# EAGLE schematic enrgymeter - Copy (EAGLE 9.0.0)
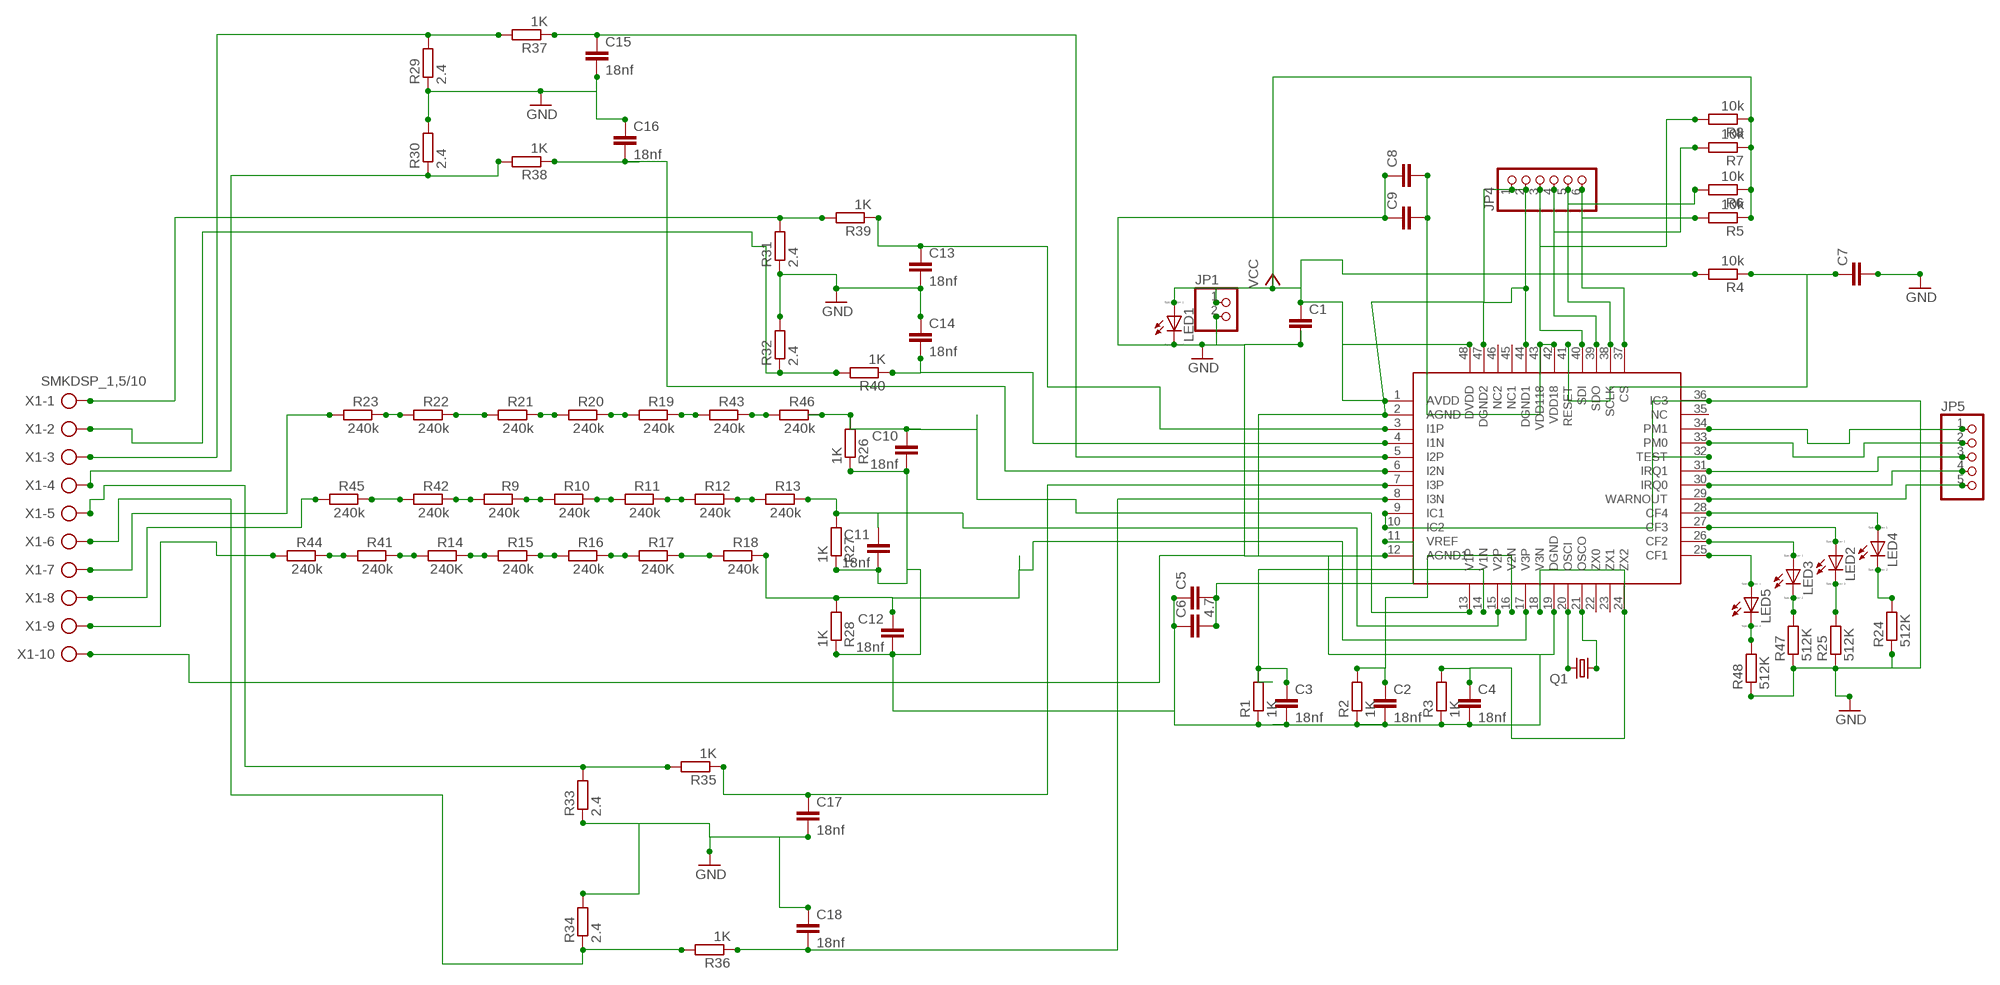
[diagram p0: schematic, sheet 1]

## Parts
C1  C-EUC1210  [C1210]
C2  18nf  C-EUC0402  [C0402]
C3  18nf  C-EUC0402  [C0402]
C4  18nf  C-EUC0402  [C0402]
C5  C-EUC1210  [C1210]
C6  4.7  C-EUC0805  [C0805]
C7  C-EUC1210  [C1210]
C8  C-EUC1210  [C1210]
C9  C-EUC1210  [C1210]
C10  18nf  C-EUC0402  [C0402]
C11  18nf  C-EUC0402  [C0402]
C12  18nf  C-EUC0402  [C0402]
C13  18nf  C-EUC0402  [C0402]
C14  18nf  C-EUC0402  [C0402]
C15  18nf  C-EUC0402  [C0402]
C16  18nf  C-EUC0402  [C0402]
C17  18nf  C-EUC0402  [C0402]
C18  18nf  C-EUC0402  [C0402]
JP1  PINHD-1X2_2.54-SMD-90°  [1X02SMD/90]
JP4  PINHD-1X6_2.54-SMD-90°  [1X06SMD/90]
JP5  PINHD-1X5_2.54-SMD-90°  [1X05SMD/90]
LED1  LED_E  [LED_1206]
LED2  LED_E  [LED_1206]
LED3  LED_E  [LED_1206]
LED4  LED_E  [LED_1206]
LED5  LED_E  [LED_1206]
Q1  CRYSTALSM49  [SM49]
R1  1K  R-EU_R2512  [R2512]
R2  1K  R-EU_R2512  [R2512]
R3  1K  R-EU_R2512  [R2512]
R4  10k  R-EU_R2512  [R2512]
R5  10k  R-EU_R2512  [R2512]
R6  10k  R-EU_R2512  [R2512]
R7  10k  R-EU_R2512  [R2512]
R8  10k  R-EU_R2512  [R2512]
R9  240k  R-EU_R2512W  [R2512W]
R10  240k  R-EU_R2512W  [R2512W]
R11  240k  R-EU_R2512W  [R2512W]
R12  240k  R-EU_R2512W  [R2512W]
R13  240k  R-EU_R2512W  [R2512W]
R14  240K  R-EU_R2512W  [R2512W]
R15  240k  R-EU_R2512W  [R2512W]
R16  240k  R-EU_R2512W  [R2512W]
R17  240K  R-EU_R2512W  [R2512W]
R18  240k  R-EU_R2512W  [R2512W]
R19  240k  R-EU_R2512W  [R2512W]
R20  240k  R-EU_R2512W  [R2512W]
R21  240k  R-EU_R2512W  [R2512W]
R22  240k  R-EU_R2512W  [R2512W]
R23  240k  R-EU_R2512W  [R2512W]
R24  512K  R-EU_R2512W  [R2512W]
R25  512K  R-EU_R2512W  [R2512W]
R26  1K  R-EU_R2512  [R2512]
R27  1K  R-EU_R2512  [R2512]
R28  1K  R-EU_R2512  [R2512]
R29  2.4  R-EU_R2512  [R2512]
R30  2.4  R-EU_R2512  [R2512]
R31  2.4  R-EU_R2512  [R2512]
R32  2.4  R-EU_R2512  [R2512]
R33  2.4  R-EU_R2512  [R2512]
R34  2.4  R-EU_R2512  [R2512]
R35  1K  R-EU_R2512  [R2512]
R36  1K  R-EU_R2512  [R2512]
R37  1K  R-EU_R2512  [R2512]
R38  1K  R-EU_R2512  [R2512]
R39  1K  R-EU_R2512  [R2512]
R40  1K  R-EU_R2512  [R2512]
R41  240k  R-EU_R2512W  [R2512W]
R42  240k  R-EU_R2512W  [R2512W]
R43  240k  R-EU_R2512W  [R2512W]
R44  240k  R-EU_R2512W  [R2512W]
R45  240k  R-EU_R2512W  [R2512W]
R46  240k  R-EU_R2512W  [R2512W]
R47  512K  R-EU_R2512W  [R2512W]
R48  512K  R-EU_R2512W  [R2512W]
U$1  M90E32AS  [M90E32AS]
X1  SMKDSP_1,5/10  [SMKDSP_1,5/10]

## Nets
GND: C1.2 C2.2 C3.2 C4.2 C5.1 C6.1 C7.2 C8.1 C9.1 C10.2 C11.2 C12.2 C13.2 C14.1 C15.2 C16.1 C17.2 C18.1 JP1.2 JP4.1 JP4.2 LED1.C R1.1 R2.1 R3.1 R24.1 R25.1 R26.1 R27.1 R28.1 R29.1 R30.2 R31.1 R32.2 R33.1 R34.2 R47.1 R48.1 U$1.2(AGND) U$1.9(IC1) U$1.10(IC2) U$1.12(AGND1) U$1.19(DGND) U$1.32(TEST) U$1.36(IC3) U$1.44(DGND1) U$1.47(DGND2) X1.10
N$1: JP4.6 R5.2 U$1.37(CS)
N$2: JP4.5 R6.2 U$1.38(SCLK)
N$3: JP4.4 R7.2 U$1.39(SDO)
N$4: JP4.3 R8.2 U$1.40(SDI)
N$5: C7.1 R4.1 U$1.41(RESET)
N$6: Q1.1 U$1.21(OSCO)
N$7: R12.1 R13.2
N$8: Q1.2 U$1.20(OSCI)
N$9: C8.2 C9.2 U$1.42(VDD18) U$1.43(VDD118)
N$10: C14.2 R40.1 U$1.4(I1N)
N$11: R31.2 R39.2 X1.1
N$12: R32.1 R40.2 X1.2
N$13: C17.1 R35.1 U$1.7(I3P)
N$14: R43.1 R46.2
N$16: R19.1 R43.2
N$17: LED4.A U$1.28(CF4)
N$19: LED2.A U$1.27(CF3)
N$20: R42.2 R45.1
N$21: LED5.C R48.2
N$22: JP5.1 U$1.34(PM1)
N$23: LED5.A U$1.25(CF1)
N$24: JP5.2 U$1.33(PM0)
N$25: JP5.3 U$1.31(IRQ1)
N$26: C11.1 R13.1 R27.2 U$1.15(V2P)
N$27: R41.2 R44.1
N$28: LED3.A U$1.26(CF2)
N$29: JP5.4 U$1.30(IRQ0)
N$31: JP5.5 U$1.29(WARNOUT)
N$32: R11.1 R12.2
N$33: R19.2 R20.1
N$34: R10.1 R11.2
N$35: R45.2 X1.8
N$36: C16.2 R38.1 U$1.6(I2N)
N$37: C10.1 R26.2 R46.1 U$1.13(V1P)
N$38: R20.2 R21.1
N$39: C3.1 R1.2 U$1.14(V1N)
N$40: C2.1 R2.2 U$1.16(V2N)
N$41: R9.1 R10.2
N$42: C4.1 R3.2 U$1.18(V3N) U$1.24(ZX2)
N$43: LED3.C R47.2
N$44: R9.2 R42.1
N$45: R34.1 R36.2 X1.6
N$46: R14.2 R41.1
N$47: C5.2 C6.2 U$1.11(VREF)
N$48: R21.2 R22.1
N$49: R14.1 R15.2
N$50: R29.2 R37.2 X1.3
N$51: R15.1 R16.2
N$52: R22.2 R23.1
N$53: R16.1 R17.2
N$55: R17.1 R18.2
N$57: C12.1 R18.1 R28.2 U$1.17(V3P)
N$58: R33.2 R35.2 X1.5
N$59: LED2.C R25.2
N$60: LED4.C R24.2
N$61: C13.1 R39.1 U$1.3(I1P)
N$63: R23.2 X1.7
N$66: R44.2 X1.9
N$71: R30.1 R38.2 X1.4
N$82: C15.1 R37.1 U$1.5(I2P)
N$87: C18.2 R36.1 U$1.8(I3N)
VCC: C1.1 JP1.1 LED1.A R4.2 R5.1 R6.1 R7.1 R8.1 U$1.1(AVDD) U$1.48(DVDD)
Unconnected: U$1.22(ZX0) U$1.23(ZX1) U$1.35(NC) U$1.45(NC1) U$1.46(NC2)

## Library data of the parts
C1-C18 = rcl:C-EU: CAPACITOR, European symbol
JP1 = pinhead-1:PINHD-1X2: PIN HEADER
JP4 = pinhead-1:PINHD-1X6: PIN HEADER
JP5 = pinhead-1:PINHD-1X5: PIN HEADER
LED1-LED5 = eagle-ltspice:LED_E: LED Source: http://www.osram.convergy.de Source: www.luxeon.com Source: www.kingbright.com; SPICEMODEL: NONE; SPICEPREFIX: D; SPICETYPE: diode
Q1 = crystal:CRYSTAL: CRYSTAL; OC_FARNELL: unknown; OC_NEWARK: unknown
R1-R48 = rcl:R-EU_: RESISTOR, European symbol
U$1 = M90E32AS:M90E32AS
X1 = con-phoenix-smkdsp:SMKDSP_1,5/10: Printklemme, Nennstrom: 17,5 A, Bemessungsspannung: 250 V, Raster: 5,0 mm Source: http://eshop.phoenixcontact.de .. 1733415.pdf; MF: FARNELL; MPN: 1733651; OC_FARNELL: 3041293; OC_NEWARK: 71C4134